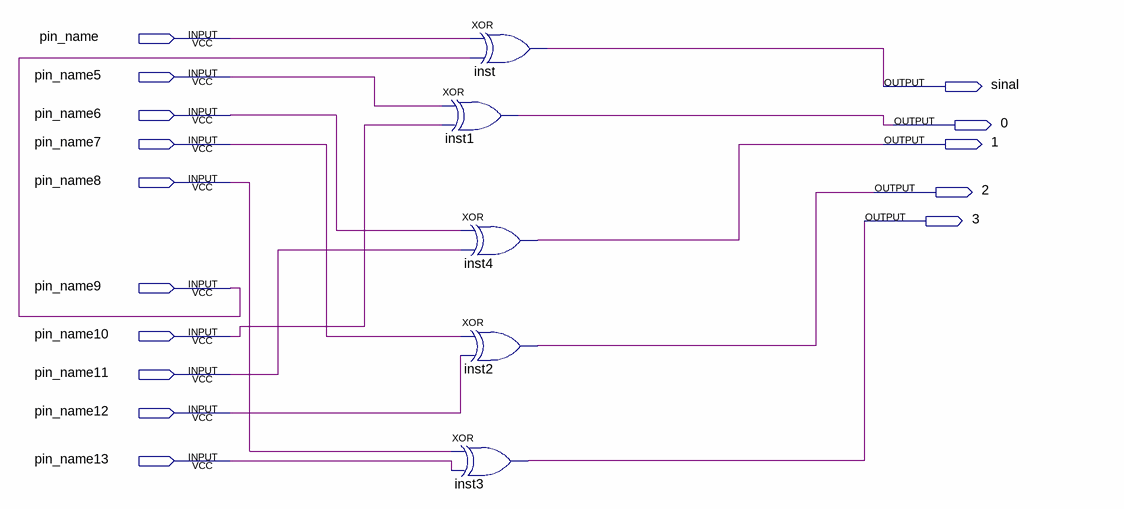
[diagram p0: schematic sheet]
// Quartus schematic funcao_xor.bdf as structural Verilog: 5 symbols, 15 pins
module funcao_xor (
  input  pin_name,
  input  pin_name5,
  input  pin_name6,
  input  pin_name7,
  input  pin_name8,
  input  pin_name9,
  input  pin_name10,
  input  pin_name11,
  input  pin_name12,
  input  pin_name13,
  output sinal,
  output \0 ,
  output \1 ,
  output \2 ,
  output \3 
);

  xor inst (sinal, pin_name, pin_name9);
  xor inst1 (\0 , pin_name5, pin_name10);
  xor inst4 (\1 , pin_name6, pin_name11);
  xor inst2 (\2 , pin_name7, pin_name12);
  xor inst3 (\3 , pin_name8, pin_name13);
endmodule
